# EAGLE design dengenn (EAGLE 9.6.2)
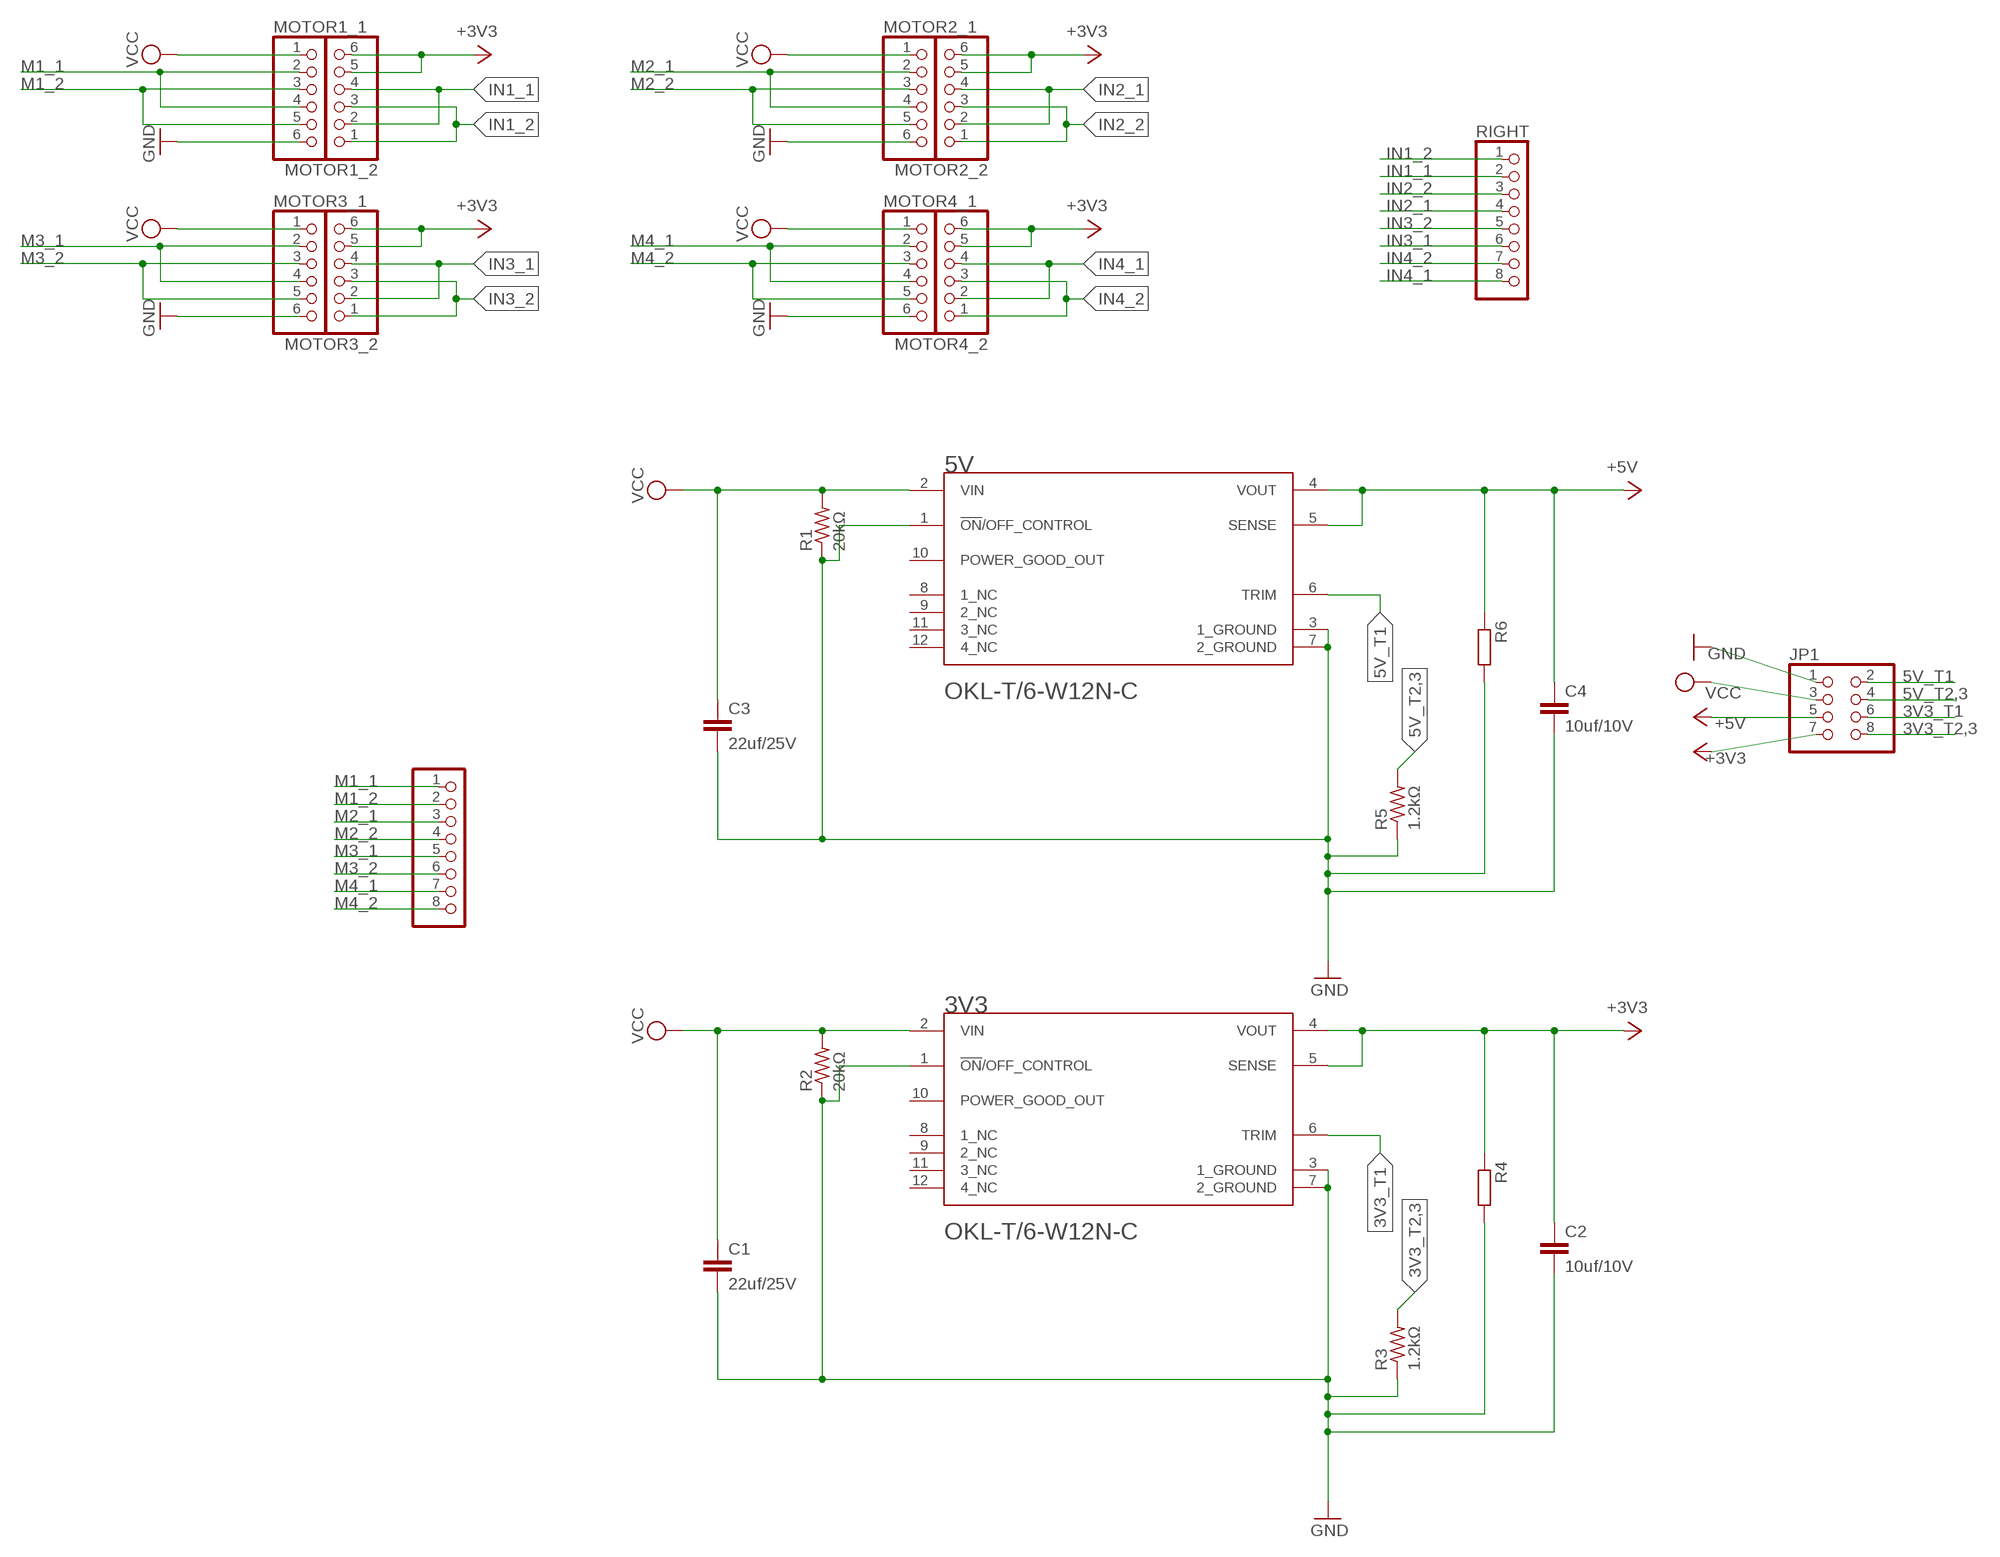
[diagram p0: schematic, sheet 1]

## Parts
3V3  OKL-T/6-W12N-CMURATA_OKL-T-6-W12N-C_0_0  [MURATA_OKL-T-6-W12N-C_0]
5V  OKL-T/6-W12N-CMURATA_OKL-T-6-W12N-C_0_0  [MURATA_OKL-T-6-W12N-C_0]
C1  22uf/25V  C-EUC1206  [C1206]
C2  10uf/10V  C-EUC0603  [C0603]
C3  22uf/25V  C-EUC1206  [C1206]
C4  10uf/10V  C-EUC0603  [C0603]
JP1  PINHD-2X4  [2X04]
LEFT  PINHD-1X8  [1X08]
MOTOR1_1  PINHD-1X06_2.54-S  [1X06-S]
MOTOR1_2  PINHD-1X06_2.54-S  [1X06-S]
MOTOR2_1  PINHD-1X06_2.54-S  [1X06-S]
MOTOR2_2  PINHD-1X06_2.54-S  [1X06-S]
MOTOR3_1  PINHD-1X06_2.54-S  [1X06-S]
MOTOR3_2  PINHD-1X06_2.54-S  [1X06-S]
MOTOR4_1  PINHD-1X06_2.54-S  [1X06-S]
MOTOR4_2  PINHD-1X06_2.54-S  [1X06-S]
R1  20kΩ  R-US_R0603  [R0603]
R2  20kΩ  R-US_R0603  [R0603]
R3  1.2kΩ  R-US_R0603  [R0603]
R4  R-EU_0309/12  [0309/12]
R5  1.2kΩ  R-US_R0603  [R0603]
R6  R-EU_0309/12  [0309/12]
RIGHT  PINHD-1X8  [1X08]

## Nets
3V3_T1: 3V3.6(TRIM) JP1.6
3V3_T2,3: JP1.8 R3.2
5V_T1: 5V.6(TRIM) JP1.2
5V_T2,3: JP1.4 R5.2
+3V3: 3V3.4(VOUT) 3V3.5(SENSE) C2.1 JP1.7 MOTOR1_2.5 MOTOR1_2.6 MOTOR2_2.5 MOTOR2_2.6 MOTOR3_2.5 MOTOR3_2.6 MOTOR4_2.5 MOTOR4_2.6 R4.1
+5V: 5V.4(VOUT) 5V.5(SENSE) C4.1 JP1.5 R6.1
GND: 3V3.1(!ON!/OFF_CONTROL) 3V3.3(1_GROUND) 3V3.7(2_GROUND) 5V.1(!ON!/OFF_CONTROL) 5V.3(1_GROUND) 5V.7(2_GROUND) C1.2 C2.2 C3.2 C4.2 JP1.1 MOTOR1_1.6 MOTOR2_1.6 MOTOR3_1.6 MOTOR4_1.6 R1.1 R2.1 R3.1 R4.2 R5.1 R6.2
IN1_1: MOTOR1_2.2 MOTOR1_2.4 RIGHT.2
IN1_2: MOTOR1_2.1 MOTOR1_2.3 RIGHT.1
IN2_1: MOTOR2_2.2 MOTOR2_2.4 RIGHT.4
IN2_2: MOTOR2_2.1 MOTOR2_2.3 RIGHT.3
IN3_1: MOTOR3_2.2 MOTOR3_2.4 RIGHT.6
IN3_2: MOTOR3_2.1 MOTOR3_2.3 RIGHT.5
IN4_1: MOTOR4_2.2 MOTOR4_2.4 RIGHT.8
IN4_2: MOTOR4_2.1 MOTOR4_2.3 RIGHT.7
M1_1: LEFT.1 MOTOR1_1.2 MOTOR1_1.4
M1_2: LEFT.2 MOTOR1_1.3 MOTOR1_1.5
M2_1: LEFT.3 MOTOR2_1.2 MOTOR2_1.4
M2_2: LEFT.4 MOTOR2_1.3 MOTOR2_1.5
M3_1: LEFT.5 MOTOR3_1.2 MOTOR3_1.4
M3_2: LEFT.6 MOTOR3_1.3 MOTOR3_1.5
M4_1: LEFT.7 MOTOR4_1.2 MOTOR4_1.4
M4_2: LEFT.8 MOTOR4_1.3 MOTOR4_1.5
VCC: 3V3.2(VIN) 5V.2(VIN) C1.1 C3.1 JP1.3 MOTOR1_1.1 MOTOR2_1.1 MOTOR3_1.1 MOTOR4_1.1 R1.2 R2.2
Unconnected: 3V3.8(1_NC) 3V3.9(2_NC) 3V3.10(POWER_GOOD_OUT) 3V3.11(3_NC) 3V3.12(4_NC) 5V.8(1_NC) 5V.9(2_NC) 5V.10(POWER_GOOD_OUT) 5V.11(3_NC) 5V.12(4_NC)

## Library data of the parts
3V3 5V = OKL-T_6-W12N-C:OKL-T/6-W12N-C: Non-Isolated PoL Module DC DC Converter 1 Output 0.591 ~ 5.5V - - 6A 4.5V - 14V Input Check availability <https://pricing.snapeda.com/parts/OKL-T/6-W12N-C/Murata%20Power%20Solutions%20Inc./view-part?ref=eda>; AVAILABILITY: In Stock; DESCRIPTION: Non-Isolated PoL Module DC DC Converter 1 Output 0.591 ~ 5.5V - - 6A 4.5V - 14V Input; MF: Murata Power Solutions Inc.; MP: OKL-T/6-W12N-C; PACKAGE: Murata Power Solutions Inc.; PRICE: None; PURCHASE-URL: https://pricing.snapeda.com/search/part/OKL-T/6-W12N-C/?ref=eda
C1-C4 = rcl:C-EU: CAPACITOR, European symbol; SPICEPREFIX: C
JP1 = pinhead:PINHD-2X4: PIN HEADER
LEFT RIGHT = pinhead:PINHD-1X8: PIN HEADER
MOTOR1_1 MOTOR1_2 MOTOR2_1 MOTOR2_2 MOTOR3_1 MOTOR3_2 MOTOR4_1 MOTOR4_2 = pinhead-2:PINHD-1X06: PIN HEADER
R1-R3 R5 = rcl:R-US_: RESISTOR, American symbol; SPICEPREFIX: R
R4 R6 = rcl:R-EU_: RESISTOR, European symbol; SPICEPREFIX: R

## Board
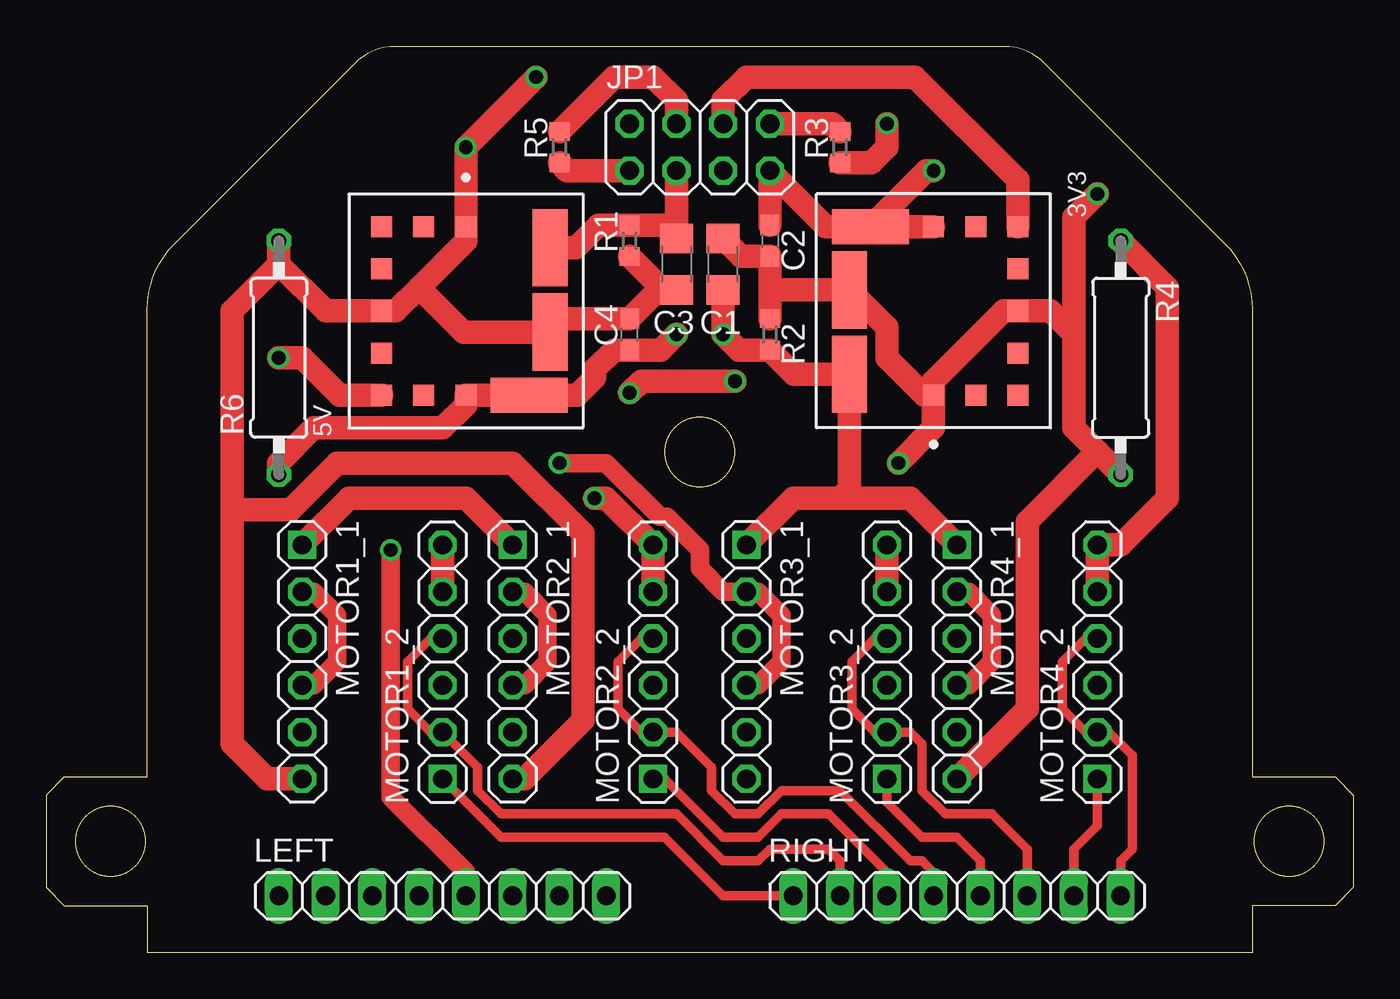
[diagram p1: board, top side]
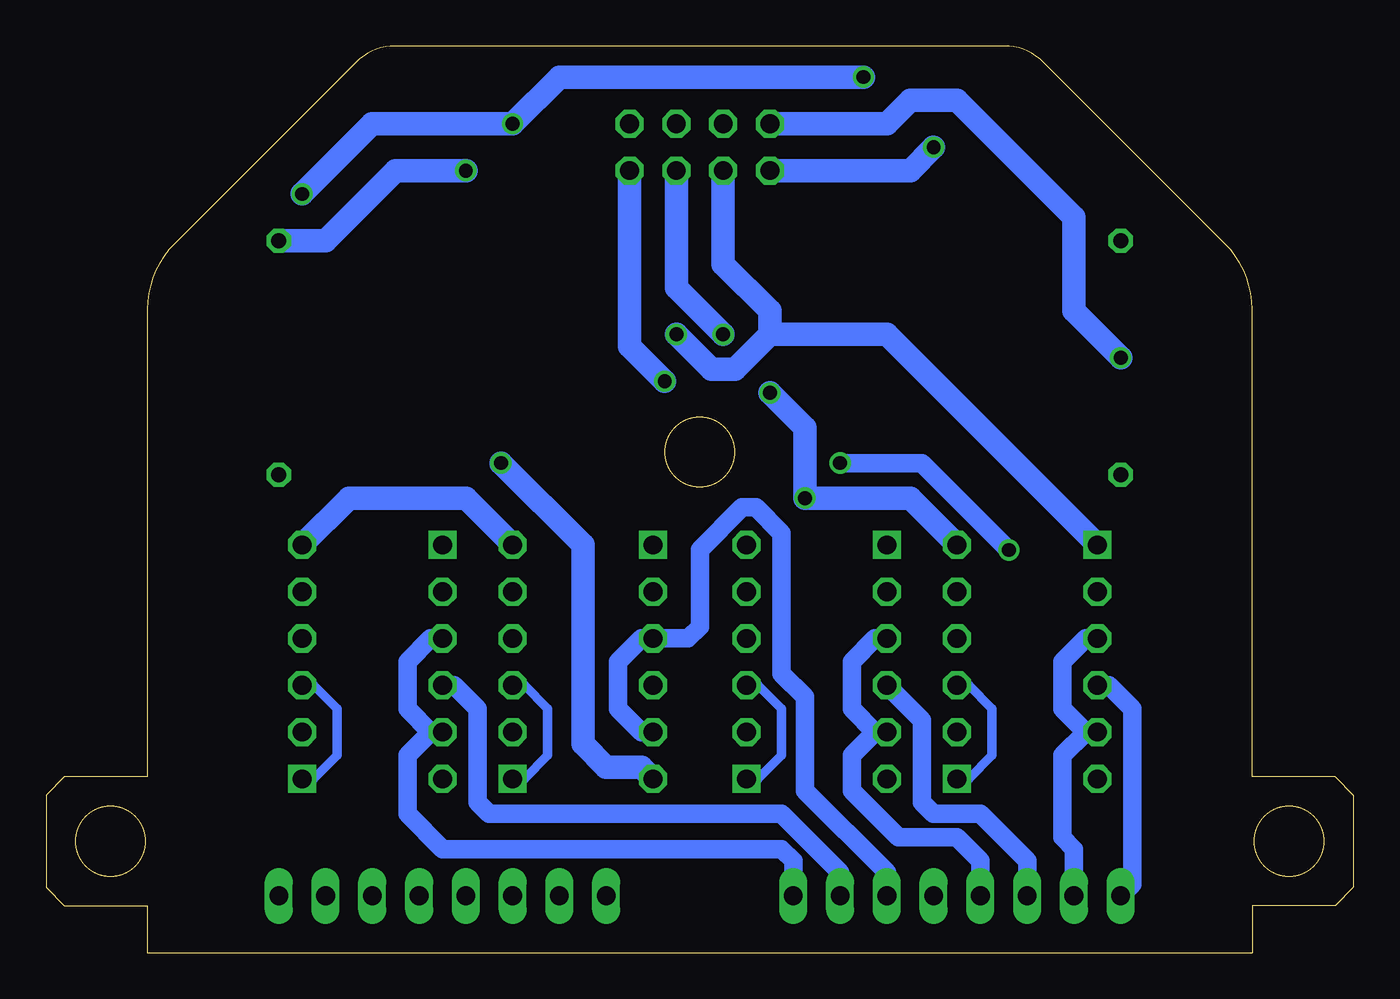
[diagram p2: board, bottom side, seen from below]

Size 71 x 49.21 mm. Coordinates in mm from the lower left corner, seen from the top.
Outline: 1,9.54 0,8.54 0,3.54 1,2.54 5.5,2.54 5.5,0 65.5,0 65.5,2.54 70,2.54 71,3.54 71,8.54 70,9.54 65.5,9.54 65.5,34.93 arc45 64.04,38.46 54.16,48.33 arc45 52.04,49.21 18.96,49.21 arc45 16.84,48.33 6.96,38.46 arc45 5.5,34.93 5.5,9.54 1,9.54
Outline: circle at 3.5,6.04 radius 1.9
Outline: circle at 67.5,6.04 radius 1.9
Outline: circle at 35.5,27.18 radius 1.9
Copper layers (1*16): Top 0.035mm / dielectric 1.5mm / Bottom 0.035mm
Design rules "default": minimum track width 6mil, minimum drill 0.35mm, track to track 6mil, track to pad 6mil, pad to pad 6mil, via to via 6mil, smd to smd 6mil, copper to edge 40mil, drill to drill 6mil, minimum pad ring 10mil, minimum via ring 8mil, stop-mask expansion 4mil, vias tented up to drill 0mil, thermal gap 10mil

### Footprints (pad centres in the part's own frame; a part is rotated, then mirrored left to right if it is on the bottom)
MURATA_OKL-T-6-W12N-C_0 = smd 1.143 x 1.143: 1 -4.572,0; 5 4.572,0; 6 4.572,-4.572; 7 0,-4.572; 8 -2.286,-4.572; 9 -4.572,-4.572; 10 -4.572,-2.286; 11 4.572,-2.286; 12 2.286,-4.572 | smd 4.191 x 1.905: 2 -3.429,4.572; 3 1.143,4.572 | smd 1.905 x 4.191: 4 4.572,3.429
C1206 = smd 1.6 x 1.8: 1 -1.4,0; 2 1.4,0
C0603 = smd 1.1 x 1: 1 -0.85,0; 2 0.85,0
2X04 = drill 1.016 octagon: 1 -3.81,-1.27; 2 -3.81,1.27; 3 -1.27,-1.27; 4 -1.27,1.27; 5 1.27,-1.27; 6 1.27,1.27; 7 3.81,-1.27; 8 3.81,1.27
1X08 = drill 1.016 long: 1 -8.89,0; 2 -6.35,0; 3 -3.81,0; 4 -1.27,0; 5 1.27,0; 6 3.81,0; 7 6.35,0; 8 8.89,0
1X06-S = drill 1.016 square: 1 -6.35,0 | drill 1.016 octagon: 2 -3.81,0; 3 -1.27,0; 4 1.27,0; 5 3.81,0; 6 6.35,0
R0603 = smd 1 x 1.1: 1 -0.85,0; 2 0.85,0
0309/12 = drill 0.813 octagon: 1 -6.35,0; 2 6.35,0

### Placement (x,y rotation side)
3V3  48.2,34.83 90 top
5V  22.8,34.83 270 top
C1  36.77,37.37 90 top
C2  39.31,38.64 270 top
C3  34.23,37.37 270 top
C4  31.69,33.56 90 top
JP1  35.5,43.72 0 top
LEFT  21.53,3.08 0 top
MOTOR1_1  13.91,15.78 270 top
MOTOR1_2  21.53,15.78 90 top
MOTOR2_1  25.34,15.78 270 top
MOTOR2_2  32.96,15.78 90 top
MOTOR3_1  38.04,15.78 270 top
MOTOR3_2  45.66,15.78 90 top
MOTOR4_1  49.47,15.78 270 top
MOTOR4_2  57.09,15.78 90 top
R1  31.69,38.64 90 top
R2  39.31,33.56 270 top
R3  43.12,43.72 90 top
R4  58.36,32.29 270 top
R5  27.88,43.72 90 top
R6  12.64,32.29 90 top
RIGHT  49.47,3.08 0 top

### Tracks (layer width: path | path; a pad name or v marks a point on that pad's centre or on a via)
3V3_T1
  Top 1.27: 3V3.6 52.77,41.94 47.18,47.53 38.04,47.53 36.77,46.26 JP1.6
3V3_T2,3
  Top 1.27: JP1.8 42.7,44.99 R3.2
5V_T1  (via drill 0.75)
  Top 1.27: v12.64,32.29 13.91,32.29 15.94,30.26 5V.6
  Bottom 1.27: JP1.2 25.34,44.99 24.07,46.26 21.53,46.26 15.18,39.91 15.18,34.83 v12.64,32.29
5V_T2,3
  Top 1.27: R5.2 30.84,47.53 32.96,47.53 34.23,46.26 JP1.4
+3V3  (via drill 0.75)
  Top 1.27: MOTOR1_2.6 MOTOR1_2.5 | MOTOR2_2.5 MOTOR2_2.6 30.42,24.67 v29.79,24.67 | MOTOR3_2.6 MOTOR3_2.5 | MOTOR4_2.5 MOTOR4_2.6 58.36,22.13 60.9,24.67 60.9,36.1 R4.1 | 3V3.4 3V3.5 | C2.1 JP1.7 42.36,39.4 3V3.4 | 3V3.4 47.82,42.45 v48.2,42.45 | v31.69,30.39 32.33,31.02 v37.41,31.02
  Bottom 1.27: MOTOR3_2.6 48.2,24.67 54.55,24.67 MOTOR4_2.6 | v48.2,42.45 52.01,42.45 55.82,38.64 R4.1 | v31.69,30.39 29.79,28.48 v29.79,24.67 24.07,24.67 MOTOR1_2.6 | v37.41,31.02 39.31,32.93 JP1.7
+5V  (via drill 0.75)
  Top 1.27: v34.23,33.56 33.38,32.71 C4.1 30.84,32.71 29.79,31.66 29.79,31.21 28.84,30.26 5V.4 5V.5 22.8,29.75 21.53,28.48 14.55,28.48 12.64,26.58 R6.1
  Bottom 1.27: JP1.5 36.77,36.1 v34.23,33.56
GND  (via drill 0.75)
  Top 1.27: MOTOR1_1.6 12,9.43 10.1,11.34 10.1,24.04 | 39.31,36.1 C2.2 37.75,37.79 C1.2 | 39.31,36.1 R2.1 | 20.26,36.1 18.99,34.83 5V.7 15.18,34.83 12.64,37.37 | 20.26,36.1 22.8,38.64 5V.1 v22.8,43.72 v26.61,47.53 | 20.26,36.1 22.67,33.69 5V.3 28.09,34.41 C4.2 33.25,35.97 C3.2 33.51,35.97 R1.1 | R6.2 12.64,37.37 | R5.1 28.3,42.45 JP1.1 | 55.82,33.56 54.55,34.83 3V3.7 52.01,34.83 48.2,31.02 3V3.1 | R4.2 57.09,27.21 | 57.09,27.21 55.82,28.48 55.82,33.56 | 3V3.1 47.69,30.26 45.66,32.29 45.66,33.94 3V3.3 39.44,35.97 39.31,36.1 | 12.64,37.37 10.1,34.83 10.1,24.04 | v45.66,44.99 45.66,43.72 44.81,42.87 R3.1 | 55.82,33.56 55.82,39.91 v57.09,41.18 | MOTOR4_1.6 53.28,13.24 53.28,23.4 57.09,27.21 | v46.3,26.58 48.2,28.48 3V3.1 | MOTOR2_1.6 25.98,9.43 29.15,12.61 29.15,22.77 25.34,26.58 15.82,26.58 13.27,24.04 10.1,24.04
  Bottom 1.27: JP1.1 24.07,42.45 v22.8,43.72 | v26.61,47.53 43.12,47.53 v45.66,44.99 53.28,44.99 v57.09,41.18 | MOTOR3_1.6 38.67,10.07 40.58,10.07 41.85,11.34 41.85,22.13 v46.3,26.58
IN1_1
  Top 0.508: MOTOR1_2.4 20.89,17.05 19.62,15.78 19.62,13.24 20.89,11.97 MOTOR1_2.2 23.44,10.07 23.44,8.8 24.7,7.53 34.23,7.53 36.77,4.99 38.67,4.99 39.31,5.62 42.48,5.62 43.12,4.99 RIGHT.2
IN1_2
  Top 0.508: MOTOR1_2.1 24.7,6.26 33.59,6.26 36.77,3.08 RIGHT.1
  Bottom 0.508: MOTOR1_2.1 20.89,9.43 19.62,10.7 19.62,13.24 20.89,14.51 MOTOR1_2.3
IN2_1
  Top 0.508: MOTOR2_2.4 32.33,17.05 31.05,15.78 31.05,13.24 32.33,11.97 MOTOR2_2.2 34.23,11.97 36.13,10.07 36.13,8.8 37.41,7.53 38.67,7.53 39.95,8.8 43.12,8.8 46.93,4.99 47.56,4.99 48.2,4.35 RIGHT.4
IN2_2
  Top 0.508: MOTOR2_2.1 33.59,9.43 36.77,6.26 38.67,6.26 39.95,7.53 42.48,7.53 45.66,4.35 RIGHT.3
  Bottom 0.508: MOTOR2_2.3 32.33,14.51 31.05,13.24 31.05,10.7 32.33,9.43 MOTOR2_2.1
IN3_1
  Top 0.508: MOTOR3_2.4 45.02,17.05 43.76,15.78 43.76,13.24 45.02,11.97 MOTOR3_2.2 46.93,11.97 47.56,11.34 47.56,8.8 48.84,7.53 51.38,7.53 53.28,5.62 RIGHT.6
IN3_2
  Top 0.508: MOTOR3_2.1 45.66,8.16 47.56,6.26 49.47,6.26 50.74,4.99 RIGHT.5
  Bottom 0.508: MOTOR3_2.3 45.02,14.51 43.76,13.24 43.76,10.7 45.02,9.43 MOTOR3_2.1
IN4_1
  Top 0.508: MOTOR4_2.4 56.45,17.05 55.19,15.78 55.19,13.24 56.45,11.97 MOTOR4_2.2 57.73,11.97 59,10.7 59,5.62 58.36,4.99 RIGHT.8
IN4_2
  Top 0.508: MOTOR4_2.1 57.09,6.89 55.82,5.62 RIGHT.7
  Bottom 0.508: MOTOR4_2.3 56.45,14.51 55.19,13.24 55.19,10.7 56.45,9.43 MOTOR4_2.1
M1_1
  Top 1.016: MOTOR1_1.4 14.55,14.51 15.82,15.78 15.82,18.32 14.55,19.59 MOTOR1_1.2
  Bottom 1.016: MOTOR1_1.4 13.27,14.51 12,13.24 12,3.72 LEFT.1
M1_2
  Bottom 1.016: MOTOR1_1.3 14.55,17.05 15.82,15.78 15.82,13.24 14.55,11.97 | MOTOR1_1.5 14.55,11.97 | 14.55,11.97 15.82,10.7 15.82,6.26 15.18,5.62 LEFT.2
M2_1
  Top 1.016: MOTOR2_1.2 25.98,19.59 27.24,18.32 27.24,15.78 25.98,14.51 MOTOR2_1.4
  Bottom 1.016: MOTOR2_1.4 23.44,12.61 23.44,8.16 22.8,7.53 20.26,7.53 17.72,4.99 LEFT.3
M2_2
  Bottom 1.016: MOTOR2_1.3 25.98,17.05 27.24,15.78 27.24,13.24 25.98,11.97 | MOTOR2_1.5 25.98,11.97 | 25.98,11.97 27.24,10.7 27.24,8.8 24.7,6.26 21.53,6.26 20.26,4.99 LEFT.4
M3_1  (via drill 0.75)
  Top 1.016: MOTOR3_1.4 38.67,14.51 39.95,15.78 39.95,18.32 38.67,19.59 MOTOR3_1.2 36.77,19.59 35.5,20.86 35.5,21.88 33.72,23.66 33.34,23.66 30.42,26.58 v27.88,26.58 | LEFT.5 22.8,4.35 18.71,8.44 v18.71,21.85
  Bottom 1.016: v18.71,21.85 23.44,26.58 v27.88,26.58
M3_2
  Bottom 1.016: MOTOR3_1.5 38.67,11.97 39.95,13.24 39.95,15.78 38.67,17.05 MOTOR3_1.3 36.13,17.05 35.5,17.69 35.5,21.88 33.21,24.16 32.45,24.16 31.05,22.77 31.05,15.15 29.79,13.88 29.79,8.8 25.34,4.35 LEFT.6
M4_1
  Top 1.016: MOTOR4_1.2 50.11,19.59 51.38,18.32 51.38,15.78 50.11,14.51 MOTOR4_1.4
  Bottom 1.016: MOTOR4_1.4 48.84,14.51 47.56,13.24 47.56,8.16 46.93,7.53 31.05,7.53 27.88,4.35 LEFT.7
M4_2
  Bottom 1.016: MOTOR4_1.5 50.11,11.97 | 50.11,11.97 51.38,13.24 51.38,15.78 50.11,17.05 MOTOR4_1.3 | 50.11,11.97 51.38,10.7 51.38,7.53 49.47,5.62 31.05,5.62 30.42,4.99 LEFT.8
VCC  (via drill 0.75)
  Top 1.27: MOTOR4_1.1 46.93,24.67 43.12,24.67 | MOTOR3_1.1 40.58,24.67 43.12,24.67 | 43.12,24.67 43.63,25.18 3V3.2 40.62,31.4 R2.2 37.62,32.71 v36.77,33.56 C1.1 | JP1.3 34.23,39.91 | 34.23,39.91 C3.1 | 34.23,39.91 33.81,39.49 R1.2 30,39.49 28.77,38.26 5V.2 | MOTOR1_1.1 16.45,24.67 22.8,24.67 MOTOR2_1.1
  Bottom 1.27: JP1.3 34.23,37.37 31.69,34.83 31.69,33.56 | 31.69,33.56 33.59,31.66 34.87,31.66 v36.77,33.56 | MOTOR1_1.1 25.34,33.56 31.69,33.56